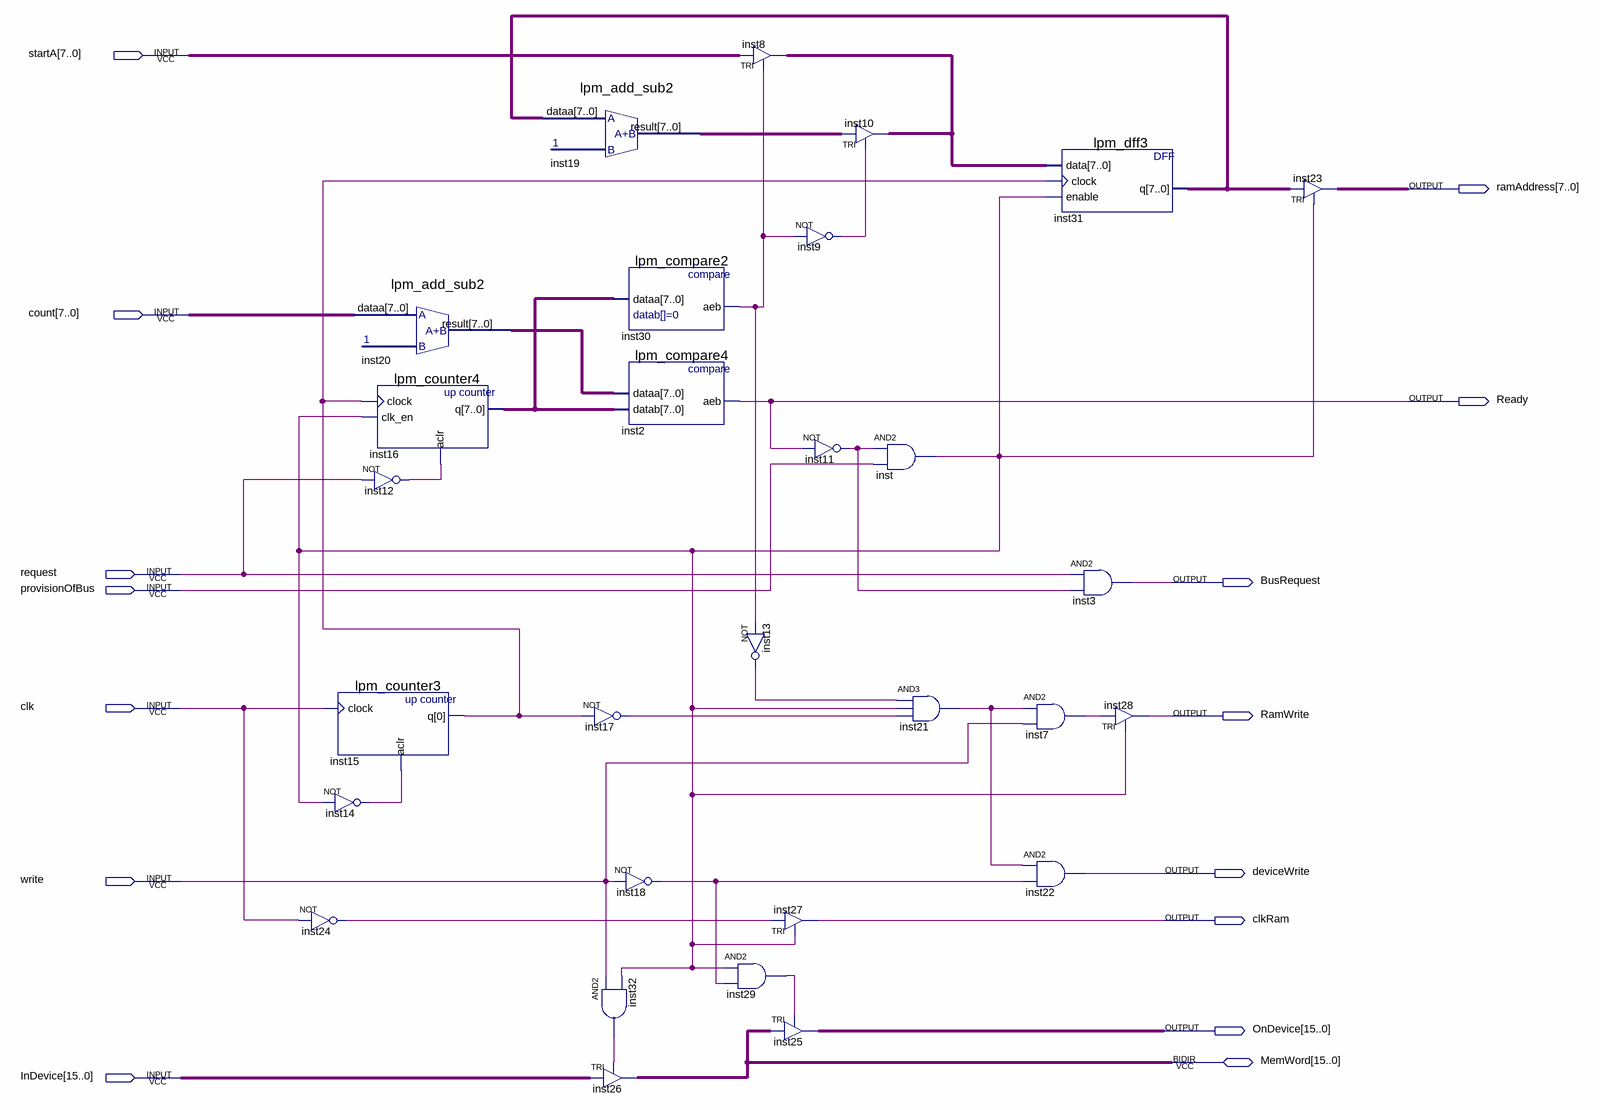
[diagram p0: schematic sheet]
// Quartus schematic DMA.bdf as structural Verilog: 29 symbols, 15 pins
module DMA (
  input  [7:0] startA,
  input  [7:0] count,
  input  request,
  input  provisionOfBus,
  input  clk,
  input  write,
  input  [15:0] InDevice,
  inout  [15:0] MemWord,
  output [7:0] ramAddress,
  output Ready,
  output BusRequest,
  output RamWrite,
  output deviceWrite,
  output clkRam,
  output [15:0] OnDevice
);

  wire inst7_out, inst9_out, inst11_out, inst12_out, inst13_out, inst14_out, inst15_q, inst17_out,
       inst18_out, inst21_out, inst24_out, inst29_out, inst30_aeb, inst32_out, inst_out;
  wire [7:0] inst8_out, inst16_q, inst19_result, inst20_result, inst31_q;

  lpm_counter3 inst15 (.clock(clk), .aclr(inst14_out), .q(inst15_q));
  not inst14 (inst14_out, inst_out);
  not inst24 (inst24_out, clk);
  lpm_add_sub2 inst20 (.dataa(count), .result(inst20_result));
  lpm_counter4 inst16 (.clock(inst15_q), .clk_en(inst_out), .aclr(inst12_out), .q(inst16_q));
  not inst12 (inst12_out, request);
  lpm_add_sub2 inst19 (.dataa(inst31_q), .result(inst19_result));
  lpm_compare2 inst30 (.dataa(inst16_q), .aeb(inst30_aeb));
  lpm_compare4 inst2 (.dataa(inst20_result), .datab(inst16_q), .aeb(Ready));
  not inst17 (inst17_out, inst15_q);
  not inst18 (inst18_out, write);
  and inst32 (inst32_out, write, inst_out);
  TRI inst26[15:0] (.IN(InDevice), .OE(inst32_out), .OUT(MemWord));
  TRI inst8[7:0] (.IN(startA), .OE(inst30_aeb), .OUT(inst8_out));
  not inst13 (inst13_out, inst30_aeb);
  and inst29 (inst29_out, inst_out, inst18_out);
  not inst9 (inst9_out, inst30_aeb);
  not inst11 (inst11_out, Ready);
  TRI inst27 (.IN(inst24_out), .OE(inst_out), .OUT(clkRam));
  TRI inst25[15:0] (.IN(MemWord), .OE(inst29_out), .OUT(OnDevice));
  TRI inst10[7:0] (.IN(inst19_result), .OE(inst9_out), .OUT(inst8_out));
  and inst (inst_out, inst11_out, provisionOfBus);
  and inst21 (inst21_out, inst13_out, inst_out, inst17_out);
  lpm_dff3 inst31 (.data(inst8_out), .clock(inst15_q), .enable(inst_out), .q(inst31_q));
  and inst3 (BusRequest, request, inst11_out);
  and inst7 (inst7_out, inst21_out, write);
  and inst22 (deviceWrite, inst21_out, inst18_out);
  TRI inst28 (.IN(inst7_out), .OE(inst_out), .OUT(RamWrite));
  TRI inst23[7:0] (.IN(inst31_q), .OE(inst_out), .OUT(ramAddress));
endmodule
